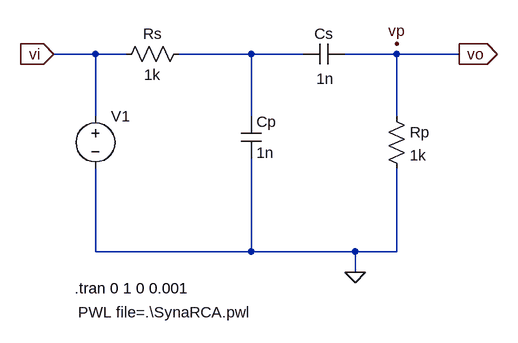
[diagram p0: schematic SynaRCA-itAdjust.asc]
SynaRCA-itAdjust.asc, the LTspice schematic file:
Version 4
SHEET 1 880 680
WIRE -256 32 -320 32
WIRE -208 32 -256 32
WIRE -16 32 -128 32
WIRE 64 32 -16 32
WIRE 208 32 128 32
WIRE 304 32 208 32
WIRE -256 128 -256 32
WIRE -16 128 -16 32
WIRE 208 128 208 32
WIRE -256 336 -256 208
WIRE -16 336 -16 192
WIRE -16 336 -256 336
WIRE 144 336 -16 336
WIRE 208 336 208 208
WIRE 208 336 144 336
WIRE 144 368 144 336
FLAG 144 368 0
FLAG 304 32 vo
IOPIN 304 32 Out
FLAG -320 32 vi
IOPIN -320 32 In
FLAG 208 16 vp
SYMBOL cap -32 128 R0
SYMATTR InstName Cp
SYMATTR Value 1n
SYMBOL res -112 16 R90
WINDOW 0 0 56 VBottom 2
WINDOW 3 32 56 VTop 2
SYMATTR InstName Rs
SYMATTR Value 1k
SYMBOL res 192 112 R0
SYMATTR InstName Rp
SYMATTR Value 1k
SYMBOL voltage -256 112 R0
WINDOW 3 -27 317 Left 2
WINDOW 123 0 0 Left 0
WINDOW 39 0 0 Left 0
SYMATTR Value PWL file=.\SynaRCA.pwl
SYMATTR InstName V1
SYMBOL cap 128 16 R90
WINDOW 0 0 32 VBottom 2
WINDOW 3 38 30 VTop 2
SYMATTR InstName Cs
SYMATTR Value 1n
TEXT -288 392 Left 2 !.tran 0 1 0 0.001

The netlist it stands for:
* SynaRCA-itAdjust.asc
Cp N001 0 1n
Rs N001 vi 1k
Rp vo 0 1k
V1 vi 0 PWL file=.\SynaRCA.pwl
Cs vo N001 1n
.tran 0 1 0 0.001
.backanno
.end